# Altium schematic sheet core.SchDoc
size A4
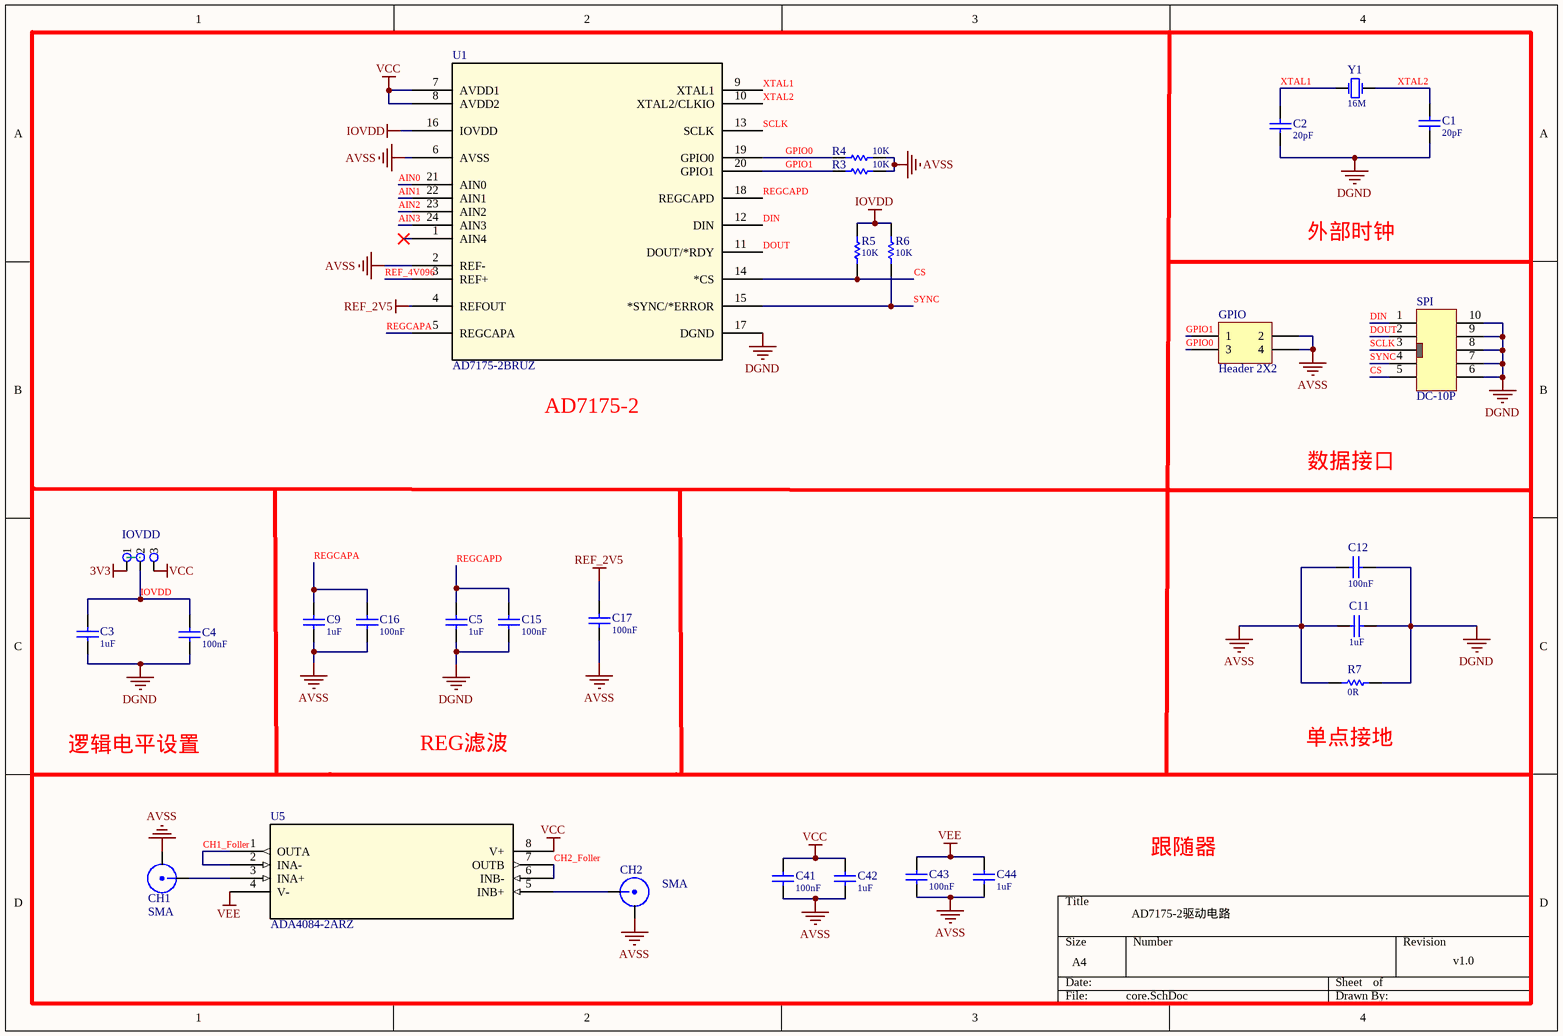
[diagram p0: core.SchDoc]

## Parts
C1  value 20pF  [C0603-L]  (hidden comment: Cap-S)
C2  value 20pF  [C0603-L]  (hidden comment: Cap-S)
C3  value 1uF  [C0603-L]  (hidden comment: Cap-S)
C4  value 100nF  [C0603-L]  (hidden comment: Cap-S)
C5  value 1uF  [C0603-L]  (hidden comment: Cap-S)
C9  value 1uF  [C0603-L]  (hidden comment: Cap-S)
C11  value 1uF  [C0603-L]  (hidden comment: Cap-S)
C12  value 100nF  [C0603-L]  (hidden comment: Cap-S)
C15  value 100nF  [C0603-L]  (hidden comment: Cap-S)
C16  value 100nF  [C0603-L]  (hidden comment: Cap-S)
C17  value 100nF  [C0603-L]  (hidden comment: Cap-S)
C41  value 100nF  [C0603-L]  (hidden comment: Cap-S)
C42  value 1uF  [C0603-L]  (hidden comment: Cap-S)
C43  value 100nF  [C0603-L]  (hidden comment: Cap-S)
C44  value 1uF  [C0603-L]  (hidden comment: Cap-S)
CH1  SMA  [SMA1]
CH2  SMA  [SMA1]
GPIO  Header 2X2  [HDR2X2]
IOVDD  Jumper  [JUMPER1x3]  (value not drawn)
R3  value 10K  [R0603-L]  (hidden comment: R)
R4  value 10K  [R0603-L]  (hidden comment: R)
R5  value 10K  [R0603-L]  (hidden comment: R)
R6  value 10K  [R0603-L]  (hidden comment: R)
R7  value 0R  [R0603-L]  (hidden comment: R)
SPI  DC-10P  [DC-10P]
U1  AD7175-2BRUZ  [RU_24_ADI]
U5  ADA4084-2ARZ  [R_8_ADI]
Y1  value 16M  [XTAL-PB2-DIP]  (hidden comment: XTAL)

## Nets
3V3: IOVDD.1
AVSS: C9.1 C11.2 C12.2 C16.1 C17.1 C41.1 C42.1 C43.1 C44.1 CH1.2 CH2.2 GPIO.2 GPIO.4 R3.1 R4.1 R7.1 U1.2(REF-) U1.6(AVSS)
DGND: C1.2 C2.2 C3.1 C4.1 C5.1 C11.1 C12.1 C15.1 R7.2 SPI.6 SPI.7 SPI.8 SPI.9 SPI.10 U1.17(DGND)
IOVDD: C3.2 C4.2 IOVDD.2 R5.2 R6.2 U1.16(IOVDD)
REF_2V5: C17.2 U1.4(REFOUT)
VCC: C41.2 C42.2 IOVDD.3 U1.7(AVDD1) U1.8(AVDD2) U5.8(V+)
VEE: C43.2 C44.2 U5.4(V-)
AIN0: U1.21(AIN0)
AIN1: U1.22(AIN1)
AIN2: U1.23(AIN2)
AIN3: U1.24(AIN3)
CH1_Foller: U5.1(OUTA) U5.2(INA-)
CH2_Foller: U5.6(INB-) U5.7(OUTB)
CS: R5.1 SPI.5 U1.14(*CS)
DIN: SPI.1 U1.12(DIN)
DOUT: SPI.2 U1.11(DOUT/*RDY)
GPIO0: GPIO.3 R4.2 U1.19(GPIO0)
GPIO1: GPIO.1 R3.2 U1.20(GPIO1)
REF_4V096: U1.3(REF+)
REGCAPA: C9.2 C16.2 U1.5(REGCAPA)
REGCAPD: C5.2 C15.2 U1.18(REGCAPD)
SCLK: SPI.3 U1.13(SCLK)
SYNC: R6.1 SPI.4 U1.15(*SYNC/*ERROR)
XTAL1: C2.1 U1.9(XTAL1) Y1.1(OSC1)
XTAL2: C1.1 U1.10(XTAL2/CLKIO) Y1.2(OSC2)
NetCH1_1: CH1.1 U5.3(INA+)
NetCH2_1: CH2.1 U5.5(INB+)

Not connected (* = marked no-connect by the designer): U1 1(AIN4)*

## Notes on the sheet
- 外部时钟
- AD7175-2
- 数据接口
- 逻辑电平设置
- REG滤波
- (near R7) 单点接地
- 跟随器
- AD7175-2驱动电路
- v1.0

## Library data of the parts
C1-C5 C9 C11 C12 C15-C17 C41-C44 = Cap-S: 贴片瓷片电容
GPIO = Header 2X2: Header, 2-Pin, Dual row; LatestRevisionDate: 17-Jul-2002; LatestRevisionNote: Re-released for DXP Platform.; Publisher: Altium Limited
IOVDD = Jumper1*3
R3-R7 = Res: 贴片电阻
U1 = AD7175-2BRUZ: No Description Available; Mfr_Name: Analog Devices Inc; Copyright: Copyright (C) 2021 Ultra Librarian. All rights reserved.; Manufacturer_Part_Number: AD7175-2BRUZ; RefDes: RefDes; Type: DEV
U5 = ADA4084-2ARZ: No Description Available; Mfr_Name: Analog Devices Inc; Copyright: Copyright (C) 2021 Ultra Librarian. All rights reserved.; Manufacturer_Part_Number: ADA4084-2ARZ; RefDes: RefDes; Type: DEV
Y1 = XTAL: 晶振